# Altium schematic sheet Overview.SchDoc: ECU overview
size A4; Engineer: Danel Tiitma; Organization: MTÜ Tudengi Vormel; Address1: Pärnu mnt 62; Address2: Tallinn; Address3: Estonia, 10135; DocumentNumber: 1; Revision: 1; SheetNumber: 1; SheetTotal: 15
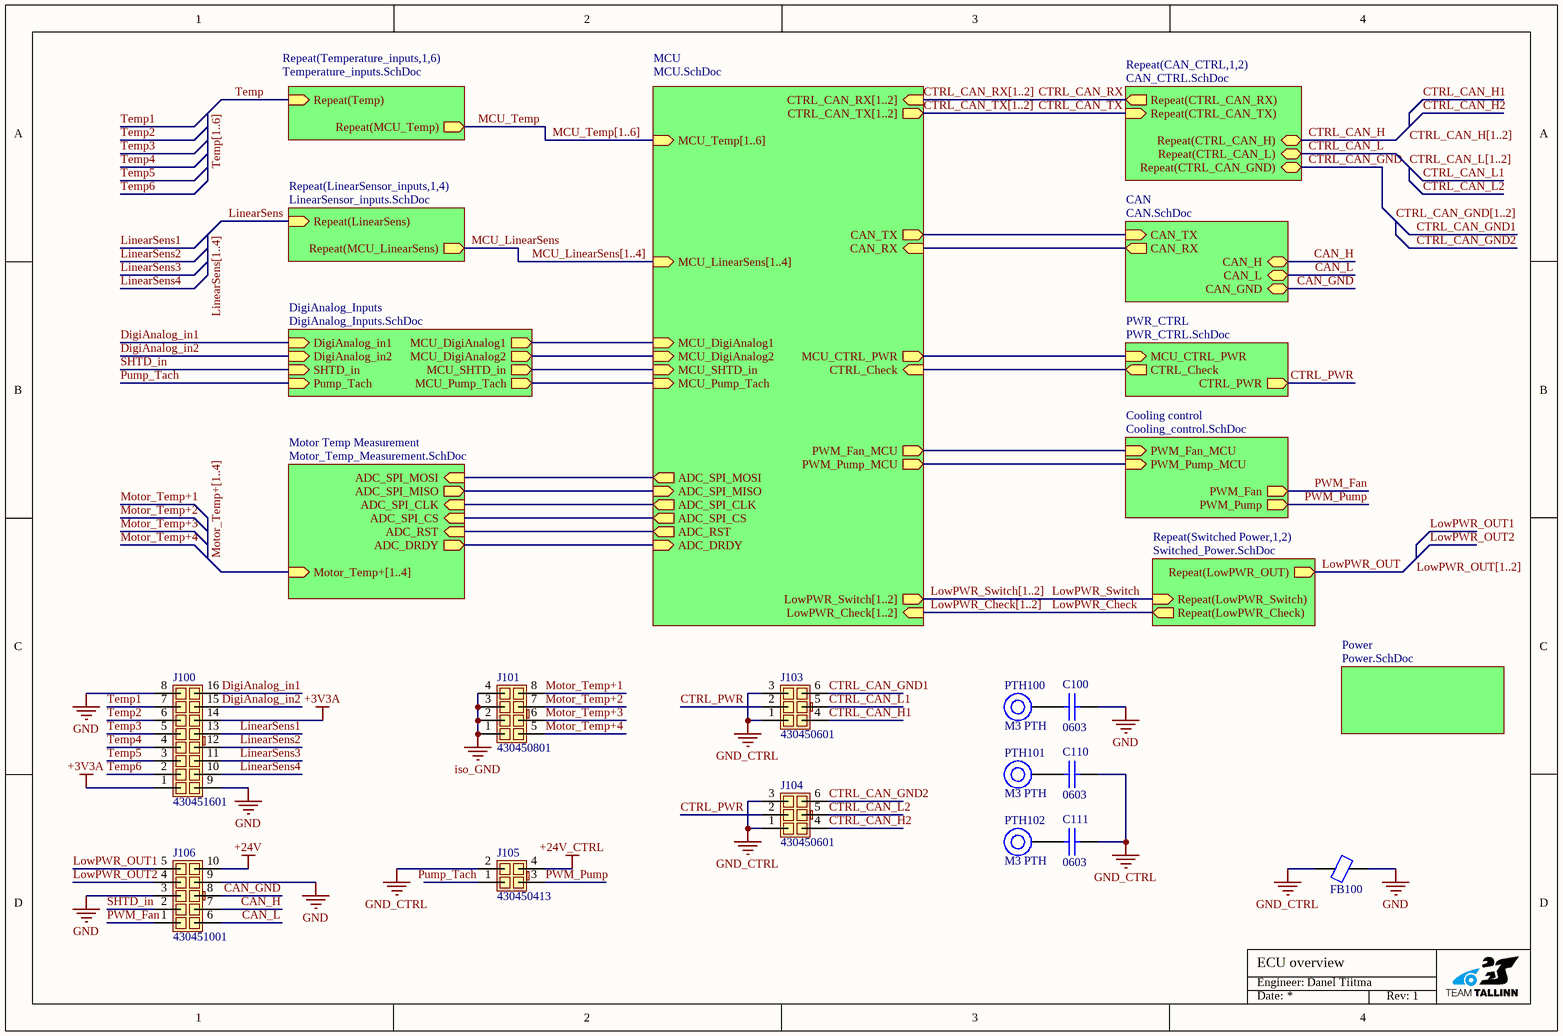
[diagram p0: Overview.SchDoc]

## Parts
C100  0603  [CAP [0603] 1608]
C110  0603  [CAP [0603] 1608]
C111  0603  [CAP [0603] 1608]
FB100  742792653  [IND [0603] 1608]  (value not drawn)
J100  430451601  [430451601]
J101  430450801  [430450801]
J103  430450601  [430450601]
J104  430450601  [430450601]
J105  430450413  [430450413]
J106  430451001  [430451001]
PTH100  M3 PTH  [M3 PTH]
PTH101  M3 PTH  [M3 PTH]
PTH102  M3 PTH  [M3 PTH]

## Sub-sheets
CAN = CAN.SchDoc: CAN_TX (in), CAN_RX (out), CAN_H (bidir), CAN_L (bidir), CAN_GND (bidir)
Cooling control = Cooling_control.SchDoc: PWM_Fan_MCU (in), PWM_Fan (out), PWM_Pump_MCU (in), PWM_Pump (out)
DigiAnalog_Inputs = DigiAnalog_Inputs.SchDoc: DigiAnalog_in1 (in), MCU_DigiAnalog1 (out), DigiAnalog_in2 (in), MCU_DigiAnalog2 (out), SHTD_in (in), Pump_Tach (in), MCU_Pump_Tach (out), MCU_SHTD_in (out)
MCU = MCU.SchDoc: MCU_Temp[1..6] (in), MCU_LinearSens[1..4] (in), CTRL_CAN_RX[1..2] (in), CTRL_CAN_TX[1..2] (out), MCU_CTRL_PWR (out), CTRL_Check (in), LowPWR_Switch[1..2] (out), LowPWR_Check[1..2] (in), MCU_DigiAnalog1 (in), MCU_DigiAnalog2 (in), MCU_Pump_Tach (in), MCU_SHTD_in (in), ADC_SPI_CLK (out), ADC_SPI_MOSI (out), ADC_SPI_CS (out), ADC_SPI_MISO (in), ADC_RST (out), ADC_DRDY (in), CAN_TX (out), CAN_RX (in), PWM_Fan_MCU (out), PWM_Pump_MCU (out)
Motor Temp Measurement = Motor_Temp_Measurement.SchDoc: ADC_SPI_CLK (in), ADC_SPI_MOSI (in), ADC_SPI_CS (in), ADC_SPI_MISO (out), ADC_RST (in), ADC_DRDY (out), Motor_Temp+[1..4] (in)
Power = Power.SchDoc: no entries
PWR_CTRL = PWR_CTRL.SchDoc: MCU_CTRL_PWR (in), CTRL_Check (out), CTRL_PWR (out)
Repeat(CAN_CTRL,1,2) = CAN_CTRL.SchDoc: Repeat(CTRL_CAN_TX) (in), Repeat(CTRL_CAN_RX) (out), Repeat(CTRL_CAN_H) (bidir), Repeat(CTRL_CAN_L) (bidir), Repeat(CTRL_CAN_GND) (bidir)
Repeat(LinearSensor_inputs,1,4) = LinearSensor_inputs.SchDoc: Repeat(MCU_LinearSens) (out), Repeat(LinearSens) (in)
Repeat(Switched Power,1,2) = Switched_Power.SchDoc: Repeat(LowPWR_Switch) (in), Repeat(LowPWR_OUT) (out), Repeat(LowPWR_Check) (out)
Repeat(Temperature_inputs,1,6) = Temperature_inputs.SchDoc: Repeat(MCU_Temp) (out), Repeat(Temp) (in)

## Nets
+3V3A: J100.1 J100.14
+24V: J106.10
+24V_CTRL: J105.4
GND: C100.1 FB100.2 J100.8 J100.9 J106.3 J106.9
GND_CTRL: C110.2 C111.2 FB100.1 J103.1 J103.3 J104.1 J104.3 J105.2
iso_GND: J101.1 J101.2 J101.3 J101.4
CAN_GND: J106.8 ; sheet CAN/CAN_GND
CAN_H: J106.7 ; sheet CAN/CAN_H
CAN_L: J106.6 ; sheet CAN/CAN_L
CTRL_CAN_GND: sheet Repeat(CAN_CTRL,1,2)/Repeat(CTRL_CAN_GND)
CTRL_CAN_GND1: J103.6
CTRL_CAN_GND2: J104.6
CTRL_CAN_H: sheet Repeat(CAN_CTRL,1,2)/Repeat(CTRL_CAN_H)
CTRL_CAN_H1: J103.4
CTRL_CAN_H2: J104.4
CTRL_CAN_L: sheet Repeat(CAN_CTRL,1,2)/Repeat(CTRL_CAN_L)
CTRL_CAN_L1: J103.5
CTRL_CAN_L2: J104.5
CTRL_CAN_RX: sheet Repeat(CAN_CTRL,1,2)/Repeat(CTRL_CAN_RX)
CTRL_CAN_TX: sheet Repeat(CAN_CTRL,1,2)/Repeat(CTRL_CAN_TX)
CTRL_PWR: J103.2 J104.2 ; sheet PWR_CTRL/CTRL_PWR
DigiAnalog_in1: J100.16 ; sheet DigiAnalog_Inputs/DigiAnalog_in1
DigiAnalog_in2: J100.15 ; sheet DigiAnalog_Inputs/DigiAnalog_in2
LinearSens: sheet Repeat(LinearSensor_inputs,1,4)/Repeat(LinearSens)
LinearSens1: J100.13
LinearSens2: J100.12
LinearSens3: J100.11
LinearSens4: J100.10
LowPWR_Check: sheet Repeat(Switched Power,1,2)/Repeat(LowPWR_Check)
LowPWR_OUT: sheet Repeat(Switched Power,1,2)/Repeat(LowPWR_OUT)
LowPWR_OUT1: J106.5
LowPWR_OUT2: J106.4
LowPWR_Switch: sheet Repeat(Switched Power,1,2)/Repeat(LowPWR_Switch)
MCU_LinearSens: sheet Repeat(LinearSensor_inputs,1,4)/Repeat(MCU_LinearSens)
MCU_Temp: sheet Repeat(Temperature_inputs,1,6)/Repeat(MCU_Temp)
Motor_Temp+1: J101.8
Motor_Temp+2: J101.7
Motor_Temp+3: J101.6
Motor_Temp+4: J101.5
Pump_Tach: J105.1 ; sheet DigiAnalog_Inputs/Pump_Tach
PWM_Fan: J106.1 ; sheet Cooling control/PWM_Fan
PWM_Pump: J105.3 ; sheet Cooling control/PWM_Pump
SHTD_in: J106.2 ; sheet DigiAnalog_Inputs/SHTD_in
Temp: sheet Repeat(Temperature_inputs,1,6)/Repeat(Temp)
Temp1: J100.7
Temp2: J100.6
Temp3: J100.5
Temp4: J100.4
Temp5: J100.3
Temp6: J100.2
NetC100_2: C100.2 PTH100.1
NetC110_1: C110.1 PTH101.1
NetC111_1: C111.1 PTH102.1
(unnamed): sheet MCU/MCU_CTRL_PWR, sheet PWR_CTRL/MCU_CTRL_PWR
(unnamed): sheet MCU/CTRL_Check, sheet PWR_CTRL/CTRL_Check
(unnamed): sheet MCU/MCU_DigiAnalog1, sheet DigiAnalog_Inputs/MCU_DigiAnalog1
(unnamed): sheet MCU/MCU_DigiAnalog2, sheet DigiAnalog_Inputs/MCU_DigiAnalog2
(unnamed): sheet MCU/MCU_Pump_Tach, sheet DigiAnalog_Inputs/MCU_Pump_Tach
(unnamed): sheet MCU/MCU_SHTD_in, sheet DigiAnalog_Inputs/MCU_SHTD_in
(unnamed): sheet MCU/ADC_SPI_CLK, sheet Motor Temp Measurement/ADC_SPI_CLK
(unnamed): sheet MCU/ADC_SPI_MOSI, sheet Motor Temp Measurement/ADC_SPI_MOSI
(unnamed): sheet MCU/ADC_SPI_CS, sheet Motor Temp Measurement/ADC_SPI_CS
(unnamed): sheet MCU/ADC_SPI_MISO, sheet Motor Temp Measurement/ADC_SPI_MISO
(unnamed): sheet MCU/ADC_RST, sheet Motor Temp Measurement/ADC_RST
(unnamed): sheet MCU/ADC_DRDY, sheet Motor Temp Measurement/ADC_DRDY
(unnamed): sheet MCU/CAN_TX, sheet CAN/CAN_TX
(unnamed): sheet MCU/CAN_RX, sheet CAN/CAN_RX
(unnamed): sheet MCU/PWM_Fan_MCU, sheet Cooling control/PWM_Fan_MCU
(unnamed): sheet MCU/PWM_Pump_MCU, sheet Cooling control/PWM_Pump_MCU

## Buses and harness runs
bus CTRL_CAN_GND[1..2]
bus CTRL_CAN_H[1..2]
bus CTRL_CAN_L[1..2]
bus CTRL_CAN_RX[1..2] = sheet MCU/CTRL_CAN_RX[1..2]
bus CTRL_CAN_TX[1..2] = sheet MCU/CTRL_CAN_TX[1..2]
bus LinearSens[1..4]
bus LowPWR_Check[1..2] = sheet MCU/LowPWR_Check[1..2]
bus LowPWR_OUT[1..2]
bus LowPWR_Switch[1..2] = sheet MCU/LowPWR_Switch[1..2]
bus MCU_LinearSens[1..4] = sheet MCU/MCU_LinearSens[1..4]
bus MCU_Temp[1..6] = sheet MCU/MCU_Temp[1..6]
bus Motor_Temp+[1..4] = sheet Motor Temp Measurement/Motor_Temp+[1..4]
bus Temp[1..6]

## Notes on the sheet
- Engineer:
- Date:
- Rev:

## Library data of the parts
C100 C110 C111 = CMP-001-00084-16: Default capacitor part; Supplier Part Number: *; Supplier: *; Manufacturer Part Number: *
FB100 = CMP-006-00000-2: Ferrite Chip, 1 Function(s), 0.5A, 2 Pin(s); Manufacturer: WURTH ELEKTRONIK; Price: 0,183; Supplier: Farnell; Manufacturer Part Number: 742792653; Supplier Part Number: 1635686
J100 = CMP-002-00099-1: Rectangular Power Connector, 16 Contact(s), Male, Solder Terminal, Receptacle; Manufacturer: Molex; Manufacturer Part Number: 43045-1601; Price: 5,60; Supplier: Mouser; Supplier Part Number: 538-43045-1601
J101 = CMP-002-00003-1: Rectangular Power Connector, 8 Contact(s), Male, Solder Terminal, Receptacle; Manufacturer: Molex; Manufacturer Part Number: 43045-0801; Price: 2,9; Supplier Part Number: 538-43045-0801; Supplier: Mouser
J103 J104 = CMP-002-00002-1: Rectangular Power Connector, 6 Contact(s), Male, Solder Terminal, Receptacle; Manufacturer: Molex; Manufacturer Part Number: 43045-0601; Supplier Part Number: 538-43045-0601; Supplier: Mouser; Price: 2,37
J105 = CMP-002-00010-1: Rectangular Power Connector, 4 Contact(s), Male, Solder Terminal, Receptacle; Manufacturer Part Number: 43045-0413; Manufacturer: Molex; Supplier Part Number: 538-43045-0413; Supplier: Mouser; Price: 0,763
J106 = CMP-00009-2: Rectangular Power Connector, 10 Contact(s), Male, Solder Terminal, Receptacle; Manufacturer: Molex; Design Item ID: 430451001; Supplier: Mouser; Supplier Part Number: 538-43045-1001; Datasheet: https://www.molex.com/pdm_docs/sd/430451000_sd.pdf; Manufacturer Part Number: 430451001; Price: 3,74 €
PTH100-PTH102 = CMP-00028-00000-3: M3 plated through hole for mounting; Manufacturer Part Number: *; Supplier Part Number: *; Supplier: *